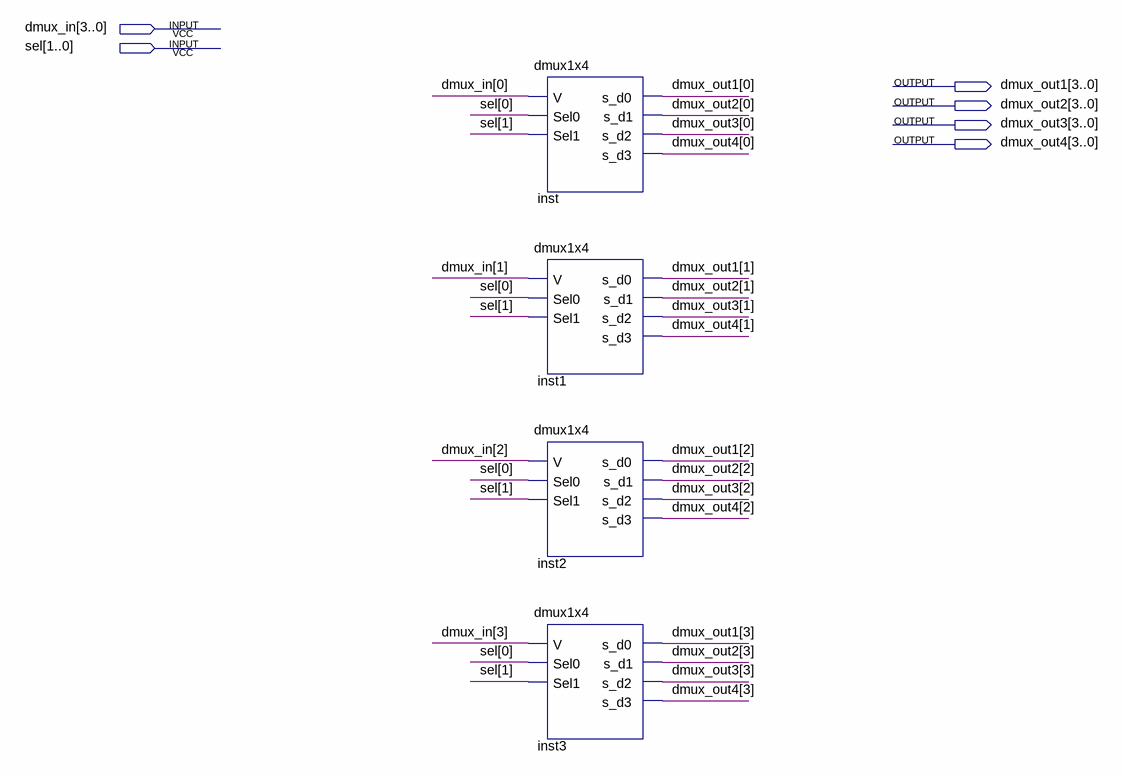
[diagram p0: schematic sheet]
// Quartus schematic dmux4bits.bdf as structural Verilog: 4 symbols, 6 pins
module dmux4bits (
  input  [3:0] dmux_in,
  input  [1:0] sel,
  output [3:0] dmux_out1,
  output [3:0] dmux_out2,
  output [3:0] dmux_out3,
  output [3:0] dmux_out4
);

  dmux1x4 inst (
    .V(dmux_in[0]), .Sel0(sel[0]), .Sel1(sel[1]), .s_d0(dmux_out1[0]), .s_d1(dmux_out2[0]),
    .s_d2(dmux_out3[0]), .s_d3(dmux_out4[0]));
  dmux1x4 inst1 (
    .V(dmux_in[1]), .Sel0(sel[0]), .Sel1(sel[1]), .s_d0(dmux_out1[1]), .s_d1(dmux_out2[1]),
    .s_d2(dmux_out3[1]), .s_d3(dmux_out4[1]));
  dmux1x4 inst2 (
    .V(dmux_in[2]), .Sel0(sel[0]), .Sel1(sel[1]), .s_d0(dmux_out1[2]), .s_d1(dmux_out2[2]),
    .s_d2(dmux_out3[2]), .s_d3(dmux_out4[2]));
  dmux1x4 inst3 (
    .V(dmux_in[3]), .Sel0(sel[0]), .Sel1(sel[1]), .s_d0(dmux_out1[3]), .s_d1(dmux_out2[3]),
    .s_d2(dmux_out3[3]), .s_d3(dmux_out4[3]));
endmodule
